# Altium schematic sheet 2.4GPA.SchDoc
size A4
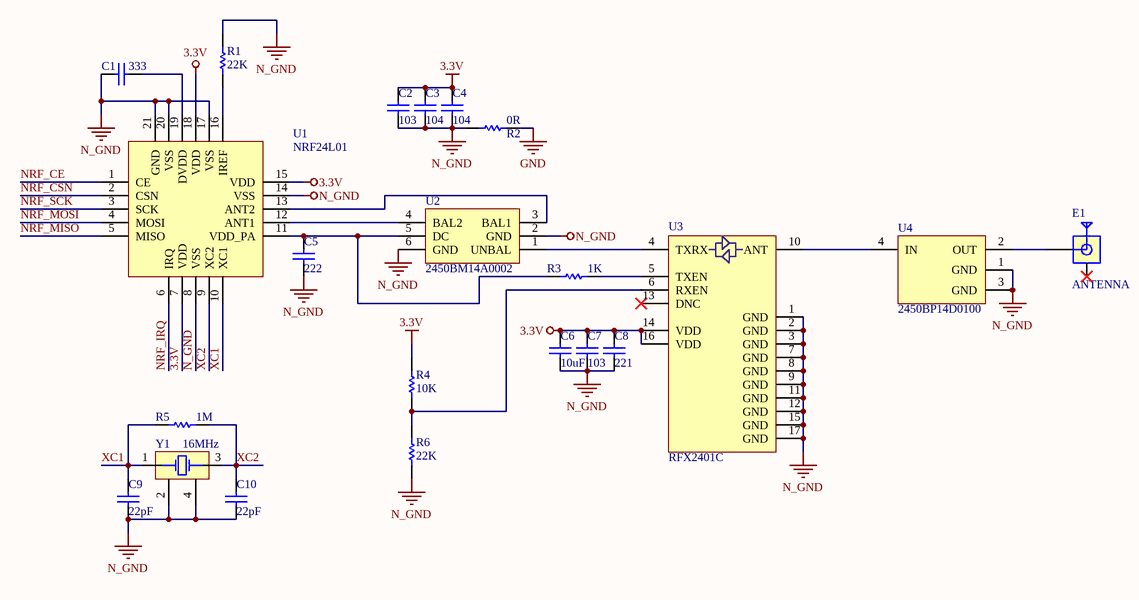
[diagram p0: 2.4GPA.SchDoc]

## Parts
C1  333  [C0603]
C2  103  [C0603]
C3  104  [C0603]
C4  104  [C0603]
C5  222  [C0603]
C6  10uF  [C0603]
C7  103  [C0603]
C8  221  [C0603]
C9  22pF  [C0603]
C10  22pF  [C0603]
E1  ANTENNA  [SMA-KHD]
R1  22K  [R0603]
R2  0R  [R0603]
R3  1K  [R0603]
R4  10K  [R0603]
R5  1M  [R0603]
R6  22K  [R0603]
U1  NRF24L01  [QFN20]
U2  2450BM14A0002  [0603-6]
U3  RFX2401C  [QFN-16]
U4  2450BP14D0100  [BALUN_250BP]
Y1  16MHz  [X-TSX-3225]

## Nets
3.3V: C2.2 C3.2 C4.2 C6.2 C7.2 C8.2 R4.1 U1.7(VDD) U1.15(VDD) U1.18(VDD) U3.14(VDD) U3.16(VDD)
GND: R2.1
N_GND: C1.2 C2.1 C3.1 C4.1 C5.1 C6.1 C7.1 C8.1 C9.1 C10.1 R1.2 R2.2 R6.2 U1.8(VSS) U1.14(VSS) U1.17(VSS) U1.20(VSS) U1.21(GND) U2.2(GND) U2.6(GND) U3.1(GND) U3.2(GND) U3.3(GND) U3.7(GND) U3.8(GND) U3.9(GND) U3.11(GND) U3.12(GND) U3.15(GND) U3.17(GND) U4.1(GND) U4.3(GND) Y1.2 Y1.4
NRF_CE: U1.1(CE)
NRF_CSN: U1.2(CSN)
NRF_IRQ: U1.6(IRQ)
NRF_MISO: U1.5(MISO)
NRF_MOSI: U1.4(MOSI)
NRF_SCK: U1.3(SCK)
XC1: C9.2 R5.1 U1.10(XC1) Y1.1
XC2: C10.2 R5.2 U1.9(XC2) Y1.3
NetC1_1: C1.1 U1.19(DVDD)
NetC5_2: C5.2 R3.2 U1.11(VDD_PA) U2.5(DC)
NetE1_1: E1.1 U4.2(OUT)
NetR1_1: R1.1 U1.16(IREF)
NetR3_1: R3.1 U3.5(TXEN)
NetR4_2: R4.2 R6.1 U3.6(RXEN)
NetU1_12: U1.12(ANT1) U2.4(BAL2)
NetU1_13: U1.13(ANT2) U2.3(BAL1)
NetU2_1: U2.1(UNBAL) U3.4(TXRX)
NetU3_10: U3.10(ANT) U4.4(IN)

Not connected (* = marked no-connect by the designer): E1 2*; U3 13(DNC)*

## Library data of the parts
C1-C10 = C0603: 电容; Published: 8-Jun-2000; LatestRevisionDate: 17-Jul-2002; LatestRevisionNote: Re-released for DXP Platform.; PackageReference: RAD-0.3; Publisher: Altium Limited; PackageDescription: Radial Cap, Thru-Hole; 2 Leads; 0.3 in Pin Spacing; UnitPrice: 0.02
R1-R6 = RES0603: 电阻; Published: 8-Jun-2000; LatestRevisionDate: 17-Jul-2002; LatestRevisionNote: Re-released for DXP Platform.; PackageReference: AXIAL-0.3; Publisher: Altium Limited; PackageDescription: Axial Device, Thru-Hole; 2 Leads; 0.3 in Pin Spacing
U1 = NRF24xx
U2 = BALUN
U4 = BALUN-1
Y1 = XTAL_1: Crystal Oscillator; Published: 8-Jun-2000; LatestRevisionDate: 17-Jul-2002; LatestRevisionNote: Re-released for DXP Platform.; Publisher: Altium Limited
E1 = ANTENNA: UnitPrice: 1.3